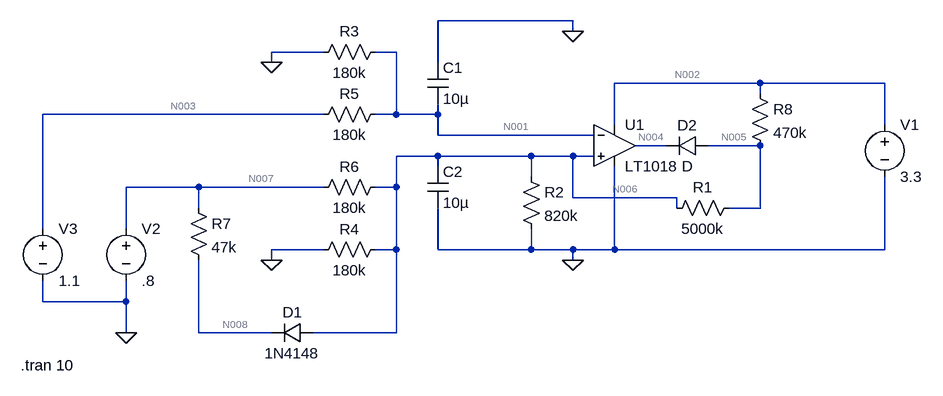
[diagram p0: schematic dbw_failsafe.asc]
dbw_failsafe.asc, the LTspice schematic file:
Version 4
SHEET 1 880 680
WIRE 96 -32 -112 -32
WIRE 96 -16 96 -32
WIRE -288 16 -368 16
WIRE -176 16 -208 16
WIRE -368 32 -368 16
WIRE -112 32 -112 -32
WIRE 384 64 160 64
WIRE 576 64 384 64
WIRE 384 80 384 64
WIRE -288 112 -720 112
WIRE -176 112 -176 16
WIRE -176 112 -208 112
WIRE -112 112 -112 96
WIRE -112 112 -176 112
WIRE 160 128 160 64
WIRE 576 128 576 64
WIRE -112 144 -112 112
WIRE 128 144 -112 144
WIRE 240 160 192 160
WIRE 384 160 304 160
WIRE -112 176 -176 176
WIRE 32 176 -112 176
WIRE 96 176 32 176
WIRE 128 176 96 176
WIRE -112 192 -112 176
WIRE 32 208 32 176
WIRE -480 224 -592 224
WIRE -288 224 -480 224
WIRE -176 224 -176 176
WIRE -176 224 -208 224
WIRE 96 240 96 176
WIRE 256 240 96 240
WIRE -480 256 -480 224
WIRE 256 256 256 240
WIRE 384 256 384 160
WIRE 384 256 336 256
WIRE -720 288 -720 112
WIRE -592 288 -592 224
WIRE -288 320 -368 320
WIRE -176 320 -176 224
WIRE -176 320 -208 320
WIRE -112 320 -112 256
WIRE 32 320 32 288
WIRE 32 320 -112 320
WIRE 96 320 32 320
WIRE 160 320 160 192
WIRE 160 320 96 320
WIRE 576 320 576 208
WIRE 576 320 160 320
WIRE -368 336 -368 320
WIRE 96 336 96 320
WIRE -720 400 -720 368
WIRE -592 400 -592 368
WIRE -592 400 -720 400
WIRE -592 448 -592 400
WIRE -480 448 -480 336
WIRE -368 448 -480 448
WIRE -176 448 -176 320
WIRE -176 448 -304 448
FLAG 96 -16 0
FLAG 96 336 0
FLAG -368 32 0
FLAG -368 336 0
FLAG -592 448 0
SYMBOL Comparators\\LT1018 160 160 R0
SYMATTR InstName U1
SYMBOL res 16 192 R0
SYMATTR InstName R2
SYMATTR Value 820k
SYMBOL res -192 0 R90
WINDOW 0 0 56 VBottom 2
WINDOW 3 32 56 VTop 2
SYMATTR InstName R3
SYMATTR Value 180k
SYMBOL res -192 304 R90
WINDOW 0 0 56 VBottom 2
WINDOW 3 32 56 VTop 2
SYMATTR InstName R4
SYMATTR Value 180k
SYMBOL res -192 96 R90
WINDOW 0 0 56 VBottom 2
WINDOW 3 32 56 VTop 2
SYMATTR InstName R5
SYMATTR Value 180k
SYMBOL res -192 208 R90
WINDOW 0 0 56 VBottom 2
WINDOW 3 32 56 VTop 2
SYMATTR InstName R6
SYMATTR Value 180k
SYMBOL cap -128 32 R0
SYMATTR InstName C1
SYMATTR Value 10µ
SYMBOL cap -128 192 R0
SYMATTR InstName C2
SYMATTR Value 10µ
SYMBOL voltage 576 112 R0
WINDOW 123 0 0 Left 0
WINDOW 39 0 0 Left 0
SYMATTR InstName V1
SYMATTR Value 3.3
SYMBOL res -496 240 R0
SYMATTR InstName R7
SYMATTR Value 47k
SYMBOL diode -304 432 R90
WINDOW 0 0 32 VBottom 2
WINDOW 3 32 32 VTop 2
SYMATTR InstName D1
SYMATTR Value 1N4148
SYMBOL res 368 64 R0
SYMATTR InstName R8
SYMATTR Value 470k
SYMBOL voltage -592 272 R0
WINDOW 123 0 0 Left 0
WINDOW 39 0 0 Left 0
SYMATTR InstName V2
SYMATTR Value .8
SYMBOL voltage -720 272 R0
WINDOW 123 0 0 Left 0
WINDOW 39 0 0 Left 0
SYMATTR InstName V3
SYMATTR Value 1.1
SYMBOL diode 304 144 R90
WINDOW 0 0 32 VBottom 2
WINDOW 3 32 32 VTop 2
SYMATTR InstName D2
SYMBOL res 352 240 R90
WINDOW 0 0 56 VBottom 2
WINDOW 3 32 56 VTop 2
SYMATTR InstName R1
SYMATTR Value 5000k
TEXT -754 498 Left 2 !.tran 10

The netlist it stands for:
* dbw_failsafe.asc
XU1 N006 N001 N002 0 N004 LT1018  ; pins In+ In- V+ V- OUT
R2 N006 0 820k
R3 N001 0 180k
R4 N006 0 180k
R5 N001 N003 180k
R6 N006 N007 180k
C1 0 N001 10µ
C2 N006 0 10µ
V1 N002 0 3.3
R7 N007 N008 47k
D1 N006 N008 1N4148
R8 N002 N005 470k
V2 N007 0 .8
V3 N003 0 1.1
D2 N005 N004 D
R1 N005 N006 5000k
.model D D
.lib standard.dio
.tran 10
.lib LTC1.lib
.backanno
.end

* Results of the author's LTspice run, read from the files saved beside the schematic
* Operating Point, zero values left out:
*   V(n002) = 3.3 V
*   V(n004) = 22.61 mV
*   V(n001) = 549.7 mV
*   V(n006) = 363.8 mV
*   V(n003) = 1.1 V
*   V(n007) = 800 mV
*   V(n008) = 799.9 mV
*   V(n005) = 544.6 mV
*   I(D2) = 5.826 µA
*   I(D1) = -2.52 nA
*   I(R1) = 36.17 nA
*   I(R8) = 5.862 µA
*   I(R7) = 2.52 nA
*   I(R6) = -2.423 µA
*   I(R5) = -3.057 µA
*   I(R4) = 2.021 µA
*   I(R3) = 3.054 µA
*   I(R2) = 443.7 nA
*   I(V3) = -3.057 µA
*   I(V2) = -2.426 µA
*   I(V1) = -167.6 µA
*   Ix(u1:1) = -2.951 nA
*   Ix(u1:2) = 3.043 nA
*   Ix(u1:3) = 161.8 µA
*   Ix(u1:4) = -167.7 µA
*   Ix(u1:5) = 5.826 µA